# EasyEDA Pro project ProPrj_Micro-Profilometer_2025-09-25.epro, board PCB
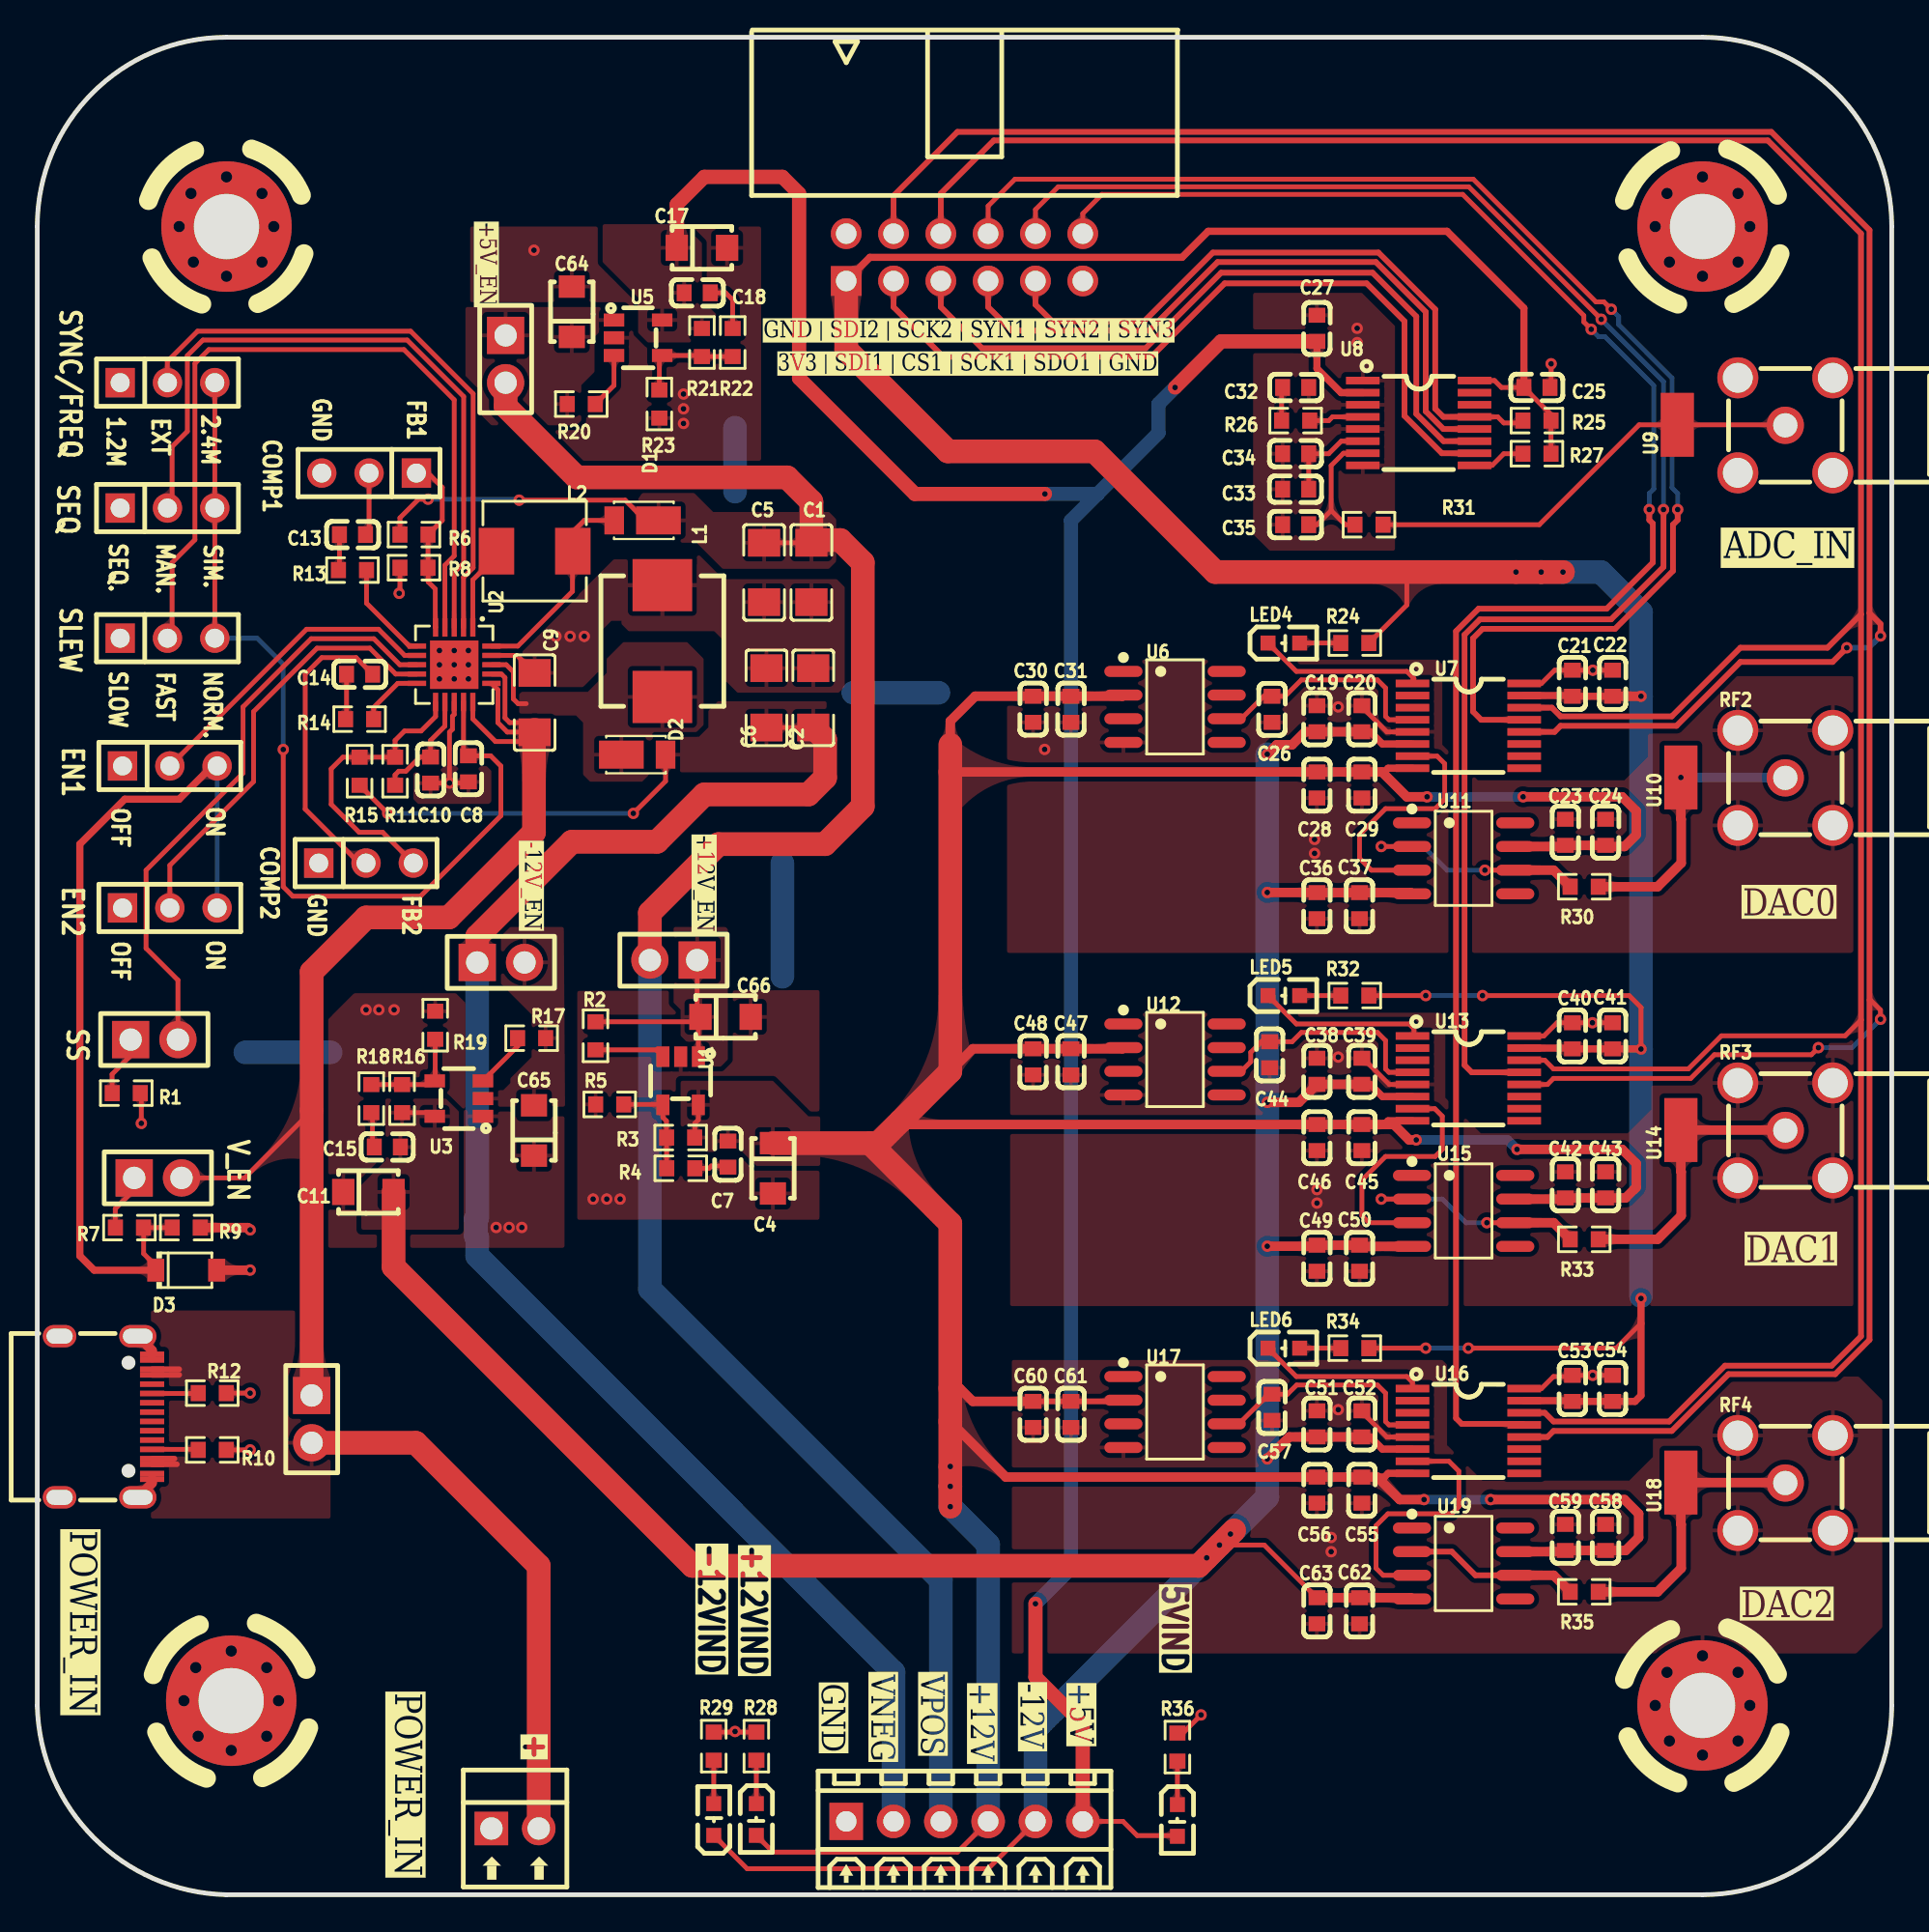
[diagram p3: board, top side]
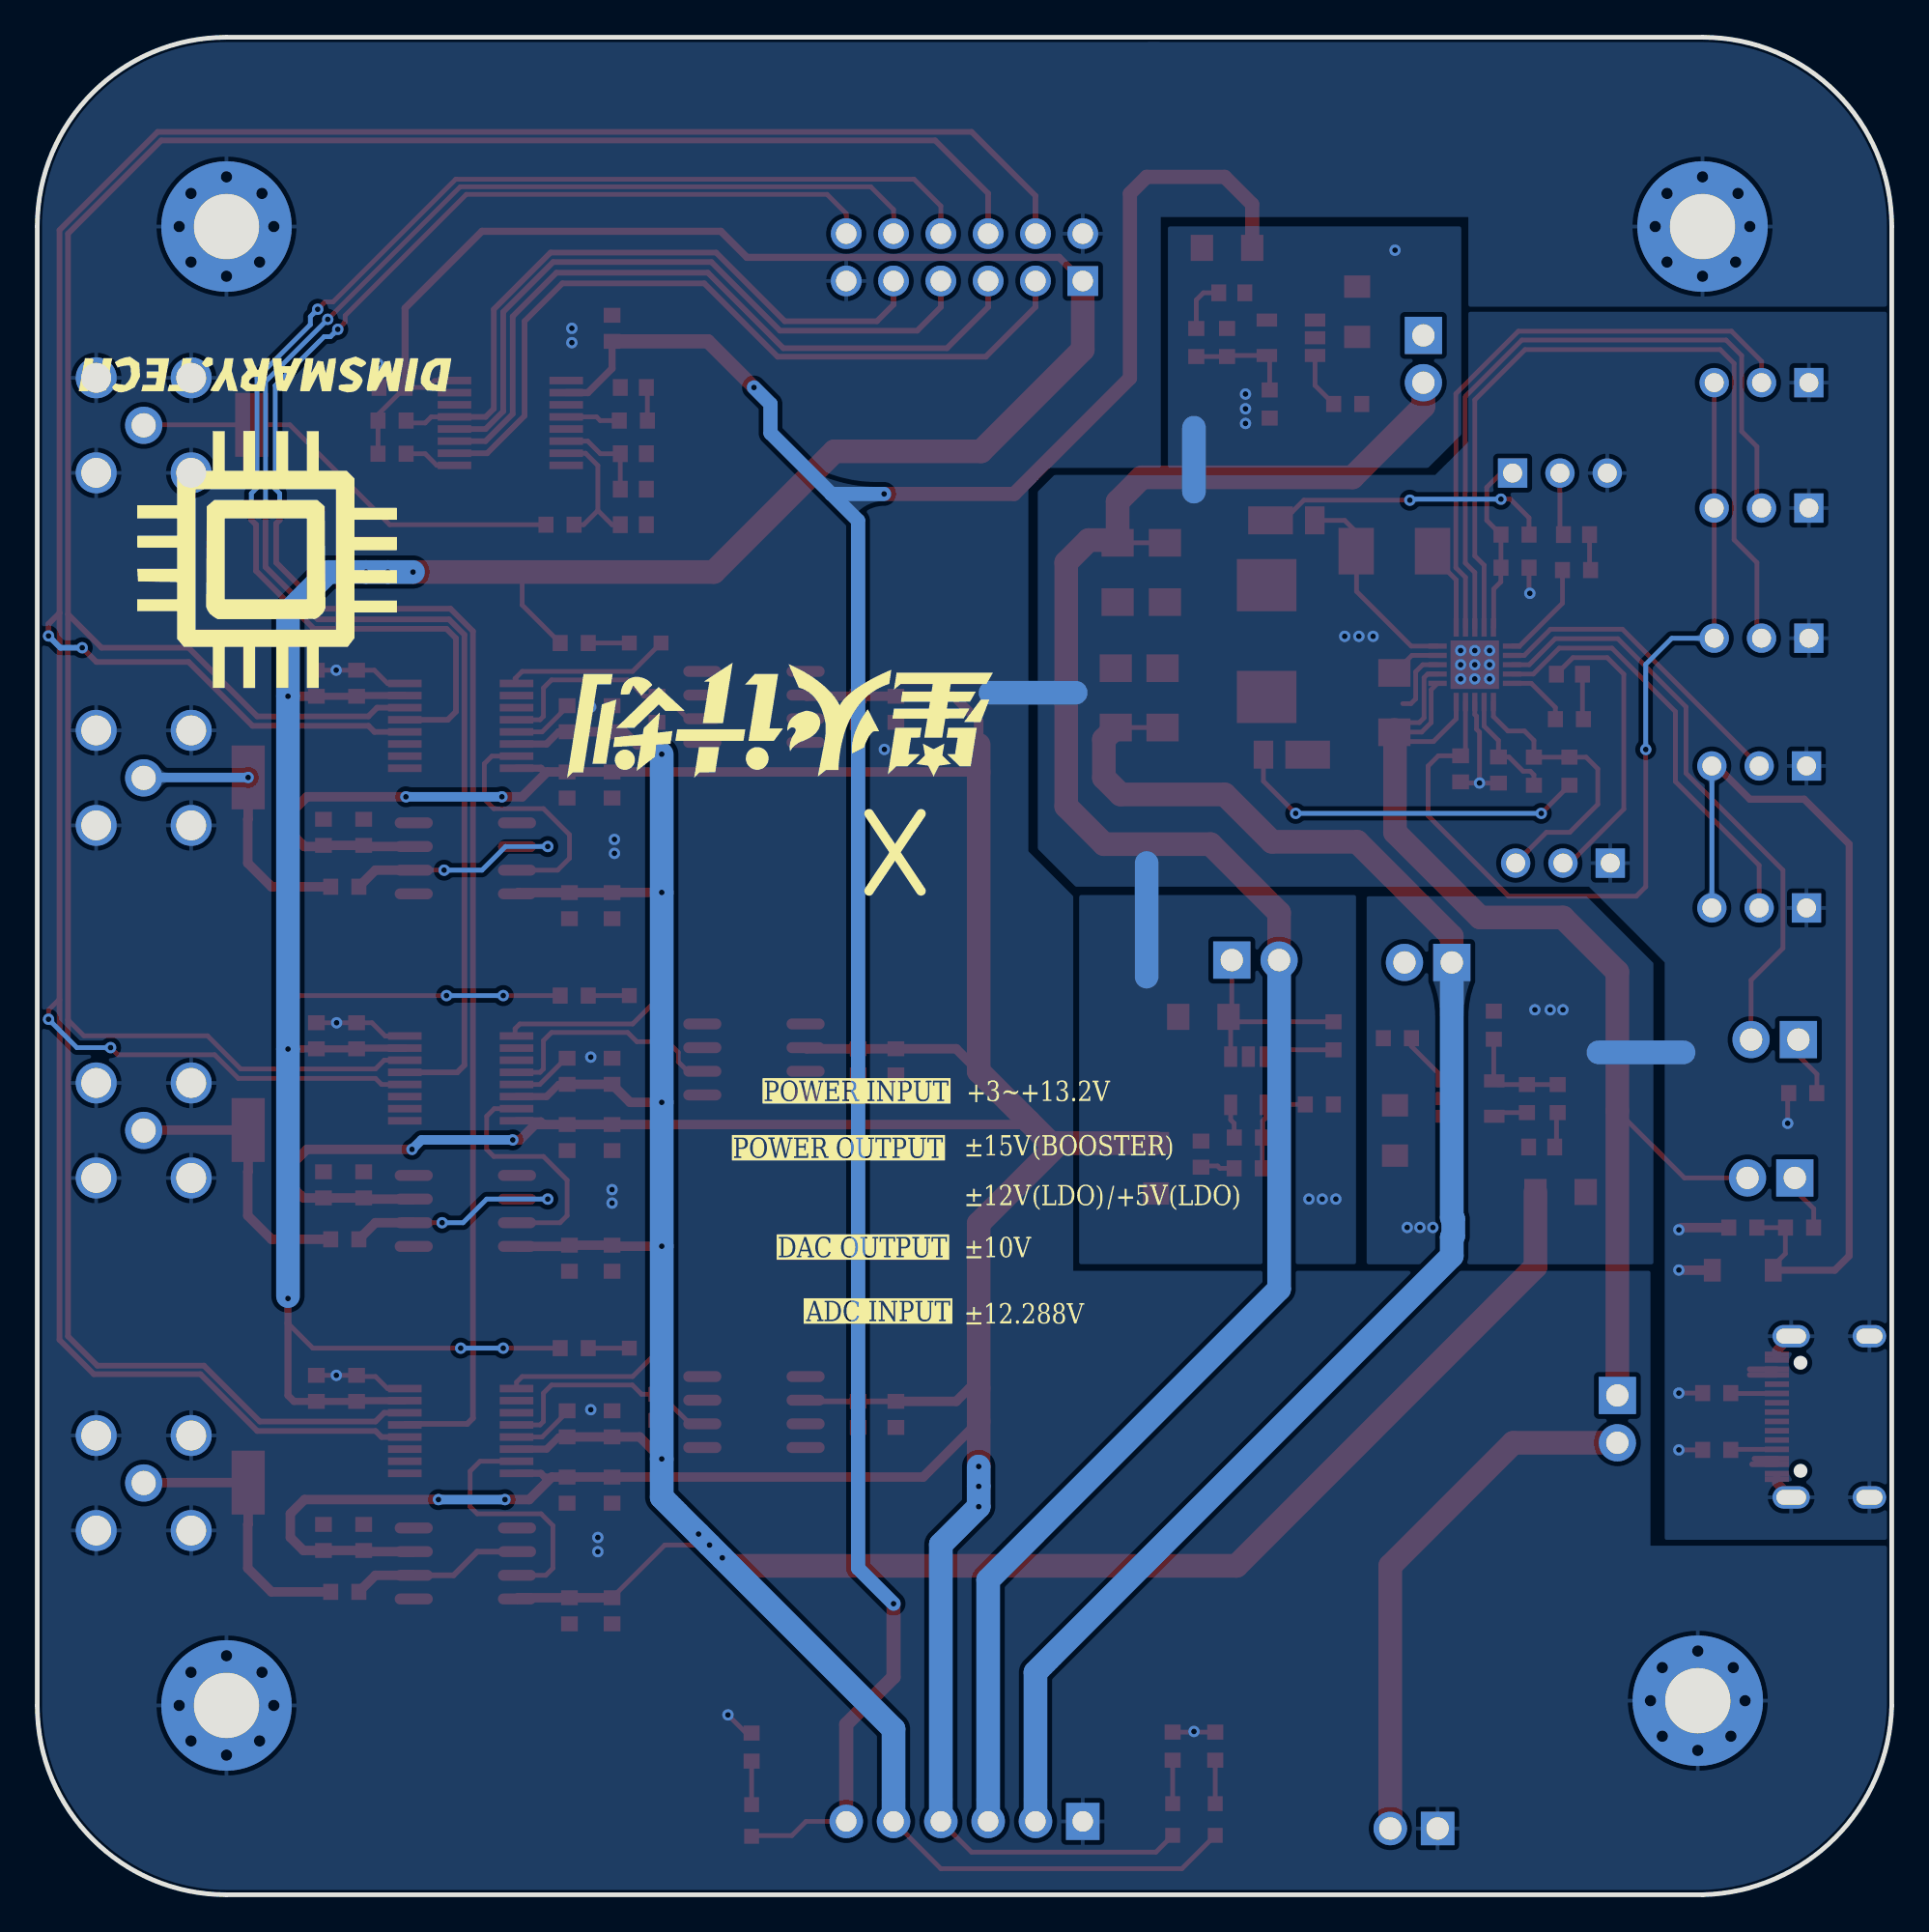
[diagram p4: board, bottom side, seen from below]

Outline 99.57 x 99.69 mm; copper layers: Top Layer, Bottom Layer. Coordinates in mm from the lower left corner of the outline.
Outline path: 0,89.53 arc(2.98,96.72) 10.16,99.69 89.41,99.69 arc(96.59,96.72) 99.57,89.53 99.57,10.16 arc(96.59,2.98) 89.41,0 10.16,0 arc(3.05,3.05) 0,10.16 0,89.53
Stack: Top Layer 0.035mm / Dielectric1 1.51mm FR4 er 4.5 / Bottom Layer 0.035mm

## Design rules (mm)
spacing safeClearance (default): track to track 0.152, other pairs 0.152 to 0.3
track width trackWidth (default): min 0.127, default 0.254, max 2.54
differential pair differentialPair (default): width min 0.127, default 0.254, max 2.54; gap min 0.152, default 0.152
via viaSize (default): diameter min 0.5, default 0.61, max 10; hole min 0.3, default 0.305, max 6

## Placement (name value [footprint] x y rotation side)
C1  10uF  [C1206]  41.56 70.97 270 top
C2  10uF  [C1206]  41.66 64.24 270 top
C4  2.2uF  [CAP-SMD_L3.2-W1.6]  39.5 38.99 270 top
C5  10uF  [C1206]  39.02 70.97 270 top
C6  10uF  [C1206]  39.15 64.24 270 top
C7  100nF  [C0603]  37.08 39.75 90 top
C8  1uF  [C0603]  23.15 60.43 270 top
C9  10uF  [C1206]  26.7 63.99 270 top
C10  1uF  [C0603]  21.12 60.36 270 top
C11  2.2uF  [CAP-SMD_L3.2-W1.6]  17.78 37.72 0 top
C13  47nF  [C0603]  16.93 73 180 top
C14  47nF  [C0603]  17.31 65.51 180 top
C15  100nF  [C0603]  18.8 40.13 0 top
C17  2.2uF  [CAP-SMD_L3.2-W1.6]  35.69 88.39 0 top
C18  100nF  [C0603]  35.43 85.98 180 top
C19  10uF  [C0603]  68.71 63.12 90 top
C20  100nF  [C0603]  71.12 63.12 90 top
C21  10uF  [C0603]  82.42 65.02 90 top
C22  100nF  [C0603]  84.58 65.02 90 top
C23  10uF  [C0603]  82.04 57.02 270 top
C24  100nF  [C0603]  84.2 57.02 270 top
C25  1uF  [C0603]  80.52 80.9 0 top
C26  100nF  [C0603]  66.29 63.63 90 top
C27  1uF  [C0603]  68.71 84.07 90 top
C28  10uF  [C0603]  68.71 59.56 90 top
C29  100nF  [C0603]  71.12 59.56 90 top
C30  10uF  [C0603]  53.47 63.63 270 top
C31  100nF  [C0603]  55.5 63.63 270 top
C32  10uF  [C0603]  67.56 80.9 180 top
C33  22uF  [C0603]  67.56 75.44 0 top
C34  1uF  [C0603]  67.56 77.34 0 top
C35  330pF  [C0603]  67.56 73.53 0 top
C36  10uF  [C0603]  68.71 53.09 90 top
C37  100nF  [C0603]  70.99 53.09 90 top
C38  10uF  [C0603]  68.71 44.2 90 top
C39  100nF  [C0603]  71.12 44.2 90 top
C40  10uF  [C0603]  82.42 46.1 90 top
C41  100nF  [C0603]  84.58 46.1 90 top
C42  10uF  [C0603]  82.04 38.1 270 top
C43  100nF  [C0603]  84.2 38.1 270 top
C44  100nF  [C0603]  66.17 45.08 90 top
C45  10uF  [C0603]  71.12 40.64 90 top
C46  100nF  [C0603]  68.71 40.64 90 top
C47  10uF  [C0603]  55.5 44.7 270 top
C48  100nF  [C0603]  53.47 44.7 270 top
C49  10uF  [C0603]  68.71 34.16 90 top
C50  100nF  [C0603]  70.99 34.16 90 top
C51  10uF  [C0603]  68.71 25.27 90 top
C52  100nF  [C0603]  71.12 25.27 90 top
C53  10uF  [C0603]  82.42 27.18 90 top
C54  100nF  [C0603]  84.58 27.18 90 top
C55  10uF  [C0603]  71.12 21.72 90 top
C56  100nF  [C0603]  68.71 21.72 90 top
C57  100nF  [C0603]  66.29 26.16 90 top
C58  10uF  [C0603]  84.2 19.18 270 top
C59  100nF  [C0603]  82.04 19.18 270 top
C60  10uF  [C0603]  53.47 25.78 270 top
C61  100nF  [C0603]  55.5 25.78 270 top
C62  10uF  [C0603]  70.99 15.24 90 top
C63  100nF  [C0603]  68.71 15.24 90 top
C64  2.2uF  [CAP-SMD_L3.2-W1.6]  28.7 84.96 90 top
C65  2.2uF  [CAP-SMD_L3.2-W1.6]  26.67 41.02 90 top
C66  2.2uF  [CAP-SMD_L3.2-W1.6]  36.96 47.12 0 top
CN1  X9555WR-2x06-6TV01  [IDC-TH_12P-P2.54_BOOMELE-2X6P]  49.78 87.88 180 top
D1  DFLS240-7  [POWERDI-123_L2.8-W1.8-LS3.7-RD]  32.17 73.76 180 top
D2  DFLS240-7  [POWERDI-123_L2.8-W1.8-LS3.7-RD]  32.55 61.19 0 top
D3  MMSZ5233B-7-F  [SOD-123_L2.7-W1.6-LS3.7-RD]  8 33.52 0 top
H1  -  [HDR-TH_3P-P2.54-V-F]  7.12 60.58 0 top
H2  -  [HDR-TH_3P-P2.54-V-F]  7.12 52.96 0 top
H3  -  [HDR-TH_3P-P2.54-V-F]  6.99 74.43 0 top
H4  -  [HDR-TH_2P-P2.54-V-F]  6.28 45.9 0 top
H5  -  [HDR-TH_2P-P2.54-V-F]  34.16 50.17 180 top
H6  -  [HDR-TH_3P-P2.54-V-F]  6.99 67.44 0 top
H7  -  [HDR-TH_3P-P2.54-V-F]  6.99 81.16 0 top
H8  -  [HDR-TH_2P-P2.54-V-F]  6.47 38.47 0 top
H9  -  [HDR-TH_2P-P2.54-V-F]  24.89 50.04 0 top
H10  -  [HDR-TH_3P-P2.54-V-F]  17.81 76.3 180 top
H11  -  [HDR-TH_3P-P2.54-V-F]  17.65 55.37 0 top
H12  -  [HDR-TH_2P-P2.54-V-F]  14.73 25.53 270 top
H13  -  [HDR-TH_2P-P2.54-V-F]  25.15 82.42 270 top
L1  6.8uH  [IND-SMD_L7.0-W6.6]  33.56 67.29 270 top
L2  4.7uH  [IND-SMD_L5.4-W5.2]  26.7 72.11 180 top
LED1  -  [LED0603-R-RD]  38.61 4.04 270 top
LED2  -  [LED0603-R-RD]  61.21 3.99 270 top
LED3  -  [LED0603-R-RD]  36.32 4.04 90 top
LED4  -  [LED0603-R-RD]  66.93 67.18 0 top
LED5  -  [LED0603-R-RD]  66.93 48.26 0 top
LED6  -  [LED0603-R-RD]  66.93 29.34 0 top
NOREF  -  [Pad_e702]  89.41 10.16 0 top
NOREF#2  -  [Pad_e389]  10.16 89.53 0 top
NOREF#3  -  [Pad_e689]  10.41 10.41 0 top
NOREF#4  -  [Pad_e670]  89.41 89.53 0 top
R1  49.9kΩ  [R0603]  4.78 43.02 180 top
R2  0Ω  [R0603]  29.97 46.1 270 top
R3  91kΩ  [R0603]  34.54 40.64 0 top
R4  1kΩ  [R0603]  34.55 38.99 0 top
R5  10kΩ  [R0603]  30.73 42.42 0 top
R6  2.43MΩ  [R0603]  20.23 73 0 top
R7  14.3kΩ  [R0603]  4.95 35.81 180 top
R8  137kΩ  [R0603]  20.23 71.22 0 top
R9  11kΩ  [R0603]  8 35.81 180 top
R10  5.1kΩ  [R0603]  9.4 23.88 180 top
R11  118kΩ  [R0603]  19.21 60.3 270 top
R12  5.1kΩ  [R0603]  9.4 26.92 0 top
R13  12kΩ  [R0603]  16.93 71.1 0 top
R14  10kΩ  [R0603]  17.31 63.1 0 top
R15  2.32MΩ  [R0603]  17.31 60.3 270 top
R16  52.3kΩ  [R0603]  19.59 42.73 270 top
R17  0Ω  [R0603]  26.54 45.97 180 top
R18  619Ω  [R0603]  17.94 42.73 270 top
R19  5.9kΩ  [R0603]  21.37 46.67 270 top
R20  0Ω  [R0603]  29.21 80.01 0 top
R21  31.6k  [R0603]  35.69 83.31 90 top
R22  1kΩ  [R0603]  37.34 83.31 90 top
R23  10k  [R0603]  33.4 80.01 90 top
R24  1kΩ  [R0603]  70.74 67.18 180 top
R25  10k  [R0603]  80.52 79.12 0 top
R26  0.47  [R0603]  67.56 79.12 0 top
R27  10k  [R0603]  80.52 77.34 0 top
R28  10kΩ  [R0603]  38.61 7.97 90 top
R29  10kΩ  [R0603]  36.32 7.97 90 top
R30  220  [R0603]  83.06 54.1 180 top
R31  0.47  [R0603]  71.5 73.53 0 top
R32  1kΩ  [R0603]  70.74 48.26 180 top
R33  220  [R0603]  83.06 35.18 180 top
R34  1kΩ  [R0603]  70.74 29.34 180 top
R35  220  [R0603]  83.06 16.26 180 top
R36  4.7kΩ  [R0603]  61.21 7.92 90 top
RF2  -  [SMA-TH_BWSMA-KWE-Z001]  93.85 59.94 0 top
RF3  -  [SMA-TH_BWSMA-KWE-Z001]  93.85 41.02 0 top
RF4  -  [SMA-TH_BWSMA-KWE-Z001]  93.85 22.1 0 top
RF9  -  [SMA-TH_BWSMA-KWE-Z001]  93.85 78.87 0 top
U1  ADP7118AUJZ-R7  [TSOT-23-5_L2.9-W1.6-P0.95-LS2.8-BR]  34.54 43.69 90 top
U2  ADP5070ACPZ-R7  [LFCSP-20_L4.0-W4.0-P0.50-TL-EP2.6]  22.39 66.02 270 top
U3  ADP7182AUJZ-R7  [TSOT-23-5_L2.9-W1.6-P0.95-LS2.8-BR]  22.64 42.73 0 top
U4  MX128-2.54-06P-GN01-Cu-Y-A  [CONN-TH_6P-P2.54_MX128-2.54-6P]  49.78 3.94 0 top
U5  ADP7118AUJZ-R7  [TSOT-23-5_L2.9-W1.6-P0.95-LS2.8-BR]  32.26 83.57 180 top
U6  -  [SOIC-8_L4.9-W3.9-P1.27-LS6.0-BL]  61.09 63.75 270 top
U7  -  [TSSOP-16_L5.0-W4.4-P0.65-LS6.4-TL]  76.84 62.74 0 top
U8  -  [TSSOP-16_L5.0-W4.4-P0.65-LS6.4-TL]  74.17 78.99 0 top
U9  -  [TEST-SMD_L2.7-W1.0]  88.05 78.89 90 top
U10  -  [TEST-SMD_L2.7-W1.0]  88.24 59.97 90 top
U11  -  [SOIC-8_L4.9-W3.9-P1.27-LS6.0-BL]  76.58 55.63 270 top
U12  -  [SOIC-8_L4.9-W3.9-P1.27-LS6.0-BL]  61.09 44.83 270 top
U13  -  [TSSOP-16_L5.0-W4.4-P0.65-LS6.4-TL]  76.84 43.81 0 top
U14  -  [TEST-SMD_L2.7-W1.0]  88.24 41.04 90 top
U15  -  [SOIC-8_L4.9-W3.9-P1.27-LS6.0-BL]  76.58 36.7 270 top
U16  -  [TSSOP-16_L5.0-W4.4-P0.65-LS6.4-TL]  76.84 24.89 0 top
U17  -  [SOIC-8_L4.9-W3.9-P1.27-LS6.0-BL]  61.09 25.91 270 top
U18  -  [TEST-SMD_L2.7-W1.0]  88.24 22.12 90 top
U19  -  [SOIC-8_L4.9-W3.9-P1.27-LS6.0-BL]  76.58 17.78 270 top
U20  DB125-2.54-2P-GN-S  [CONN-TH_DB125-2.54-2P-GN]  25.65 3.56 0 top
USBC1  -  [USB-C_SMD-TYPE-C-31-M-12]  3.68 25.65 270 top

## Footprints (pads in the part's own frame, mm; a bottom-side part is the same pattern mirrored in y, then rotated)
C0603
  rect 0.8x0.9 smd: 1(-0.7,0) 2(0.7,0)
C1206
  rect 1.485x1.728 smd: 1(-1.593,0) 2(1.593,0)
CAP-SMD_L3.2-W1.6
  rect 1.2x1.4 smd: 1(-1.35,0) 2(1.35,0)
CONN-TH_6P-P2.54_MX128-2.54-6P
  rect 1.8x2 hole 1.1: 1(-6.35,0)
  round 1.8 hole 1.1: 2(-3.81,0) 3(-1.27,0) 4(1.27,0) 5(3.81,0) 6(6.35,0)
CONN-TH_DB125-2.54-2P-GN
  rect 1.8x1.8 hole 1.2: 1(-1.27,0)
  round 1.8 hole 1.2: 2(1.27,0)
HDR-TH_2P-P2.54-V-F
  rect 1.999x1.999 hole 1.199: 1(-1.27,0)
  round 1.999 hole 1.199: 2(1.27,0)
HDR-TH_3P-P2.54-V-F
  rect 1.575x1.575 hole 1.02: 1(-2.54,0)
  round 1.575 hole 1.02: 2(0,0) 3(2.54,0)
IDC-TH_12P-P2.54_BOOMELE-2X6P
  rect 1.65x1.6 hole 1.1: 1(6.35,1.27)
  round 1.65 hole 1.1: 2(6.35,-1.27) 3(3.81,1.27) 4(3.81,-1.27) 5(1.27,1.27) 6(1.27,-1.27) 7(-1.27,1.27) 8(-1.27,-1.27) 9(-3.81,1.27) 10(-3.81,-1.27) 11(-6.35,1.27) 12(-6.35,-1.27)
IND-SMD_L5.4-W5.2
  rect 1.9x2.5 smd: 1(2.05,0) 2(-2.05,0)
IND-SMD_L7.0-W6.6
  rect 2.8x3.2 smd: 1(-3,0) 2(3,0)
LED0603-R-RD
  rect 0.8x0.8 smd: 1(0.851,0) 2(-0.851,0)
LFCSP-20_L4.0-W4.0-P0.50-TL-EP2.6
  rect 0.985x0.28 smd: 1(-2,1) 2(-2,0.5) 3(-2,0) 4(-2,-0.5) 5(-2,-1) 11(2,-1) 12(2,-0.5) 13(2,0) 14(2,0.5) 15(2,1)
  rect 0.28x0.985 smd: 6(-1,-2) 7(-0.5,-2) 8(0,-2) 9(0.5,-2) 10(1,-2) 16(1,2) 17(0.5,2) 18(0,2) 19(-0.5,2) 20(-1,2)
  rect 2.6x2.6 smd: 21(0,0)
Pad_e389
  round 7 hole 3.5: 1(0,0)
Pad_e670
  round 7 hole 3.5: 1(0,0)
Pad_e689
  round 7 hole 3.5: 1(0,0)
Pad_e702
  round 7 hole 3.5: 1(0,0)
POWERDI-123_L2.8-W1.8-LS3.7-RD
  rect 2.4x1.5 smd: 1(-1.188,0)
  rect 1.05x1.5 smd: 2(1.188,0)
R0603
  rect 0.807x0.864 smd: 1(-0.754,0) 2(0.754,0)
SMA-TH_BWSMA-KWE-Z001
  round 2.2 hole 1.6: 1(-2.55,-2.55) 2(-2.55,2.55) 3(2.55,2.55) 4(2.55,-2.55)
  round 2 hole 1.3: 5(0,0)
SOD-123_L2.7-W1.6-LS3.7-RD
  rect 0.91x1.22 smd: 1(-1.635,0) 2(1.635,0)
SOIC-8_L4.9-W3.9-P1.27-LS6.0-BL
  oval 0.59x2.045 smd: 1(-1.905,-2.771) 2(-0.635,-2.771) 3(0.635,-2.771) 4(1.905,-2.771) 5(1.905,2.773) 6(0.635,2.773) 7(-0.635,2.773) 8(-1.905,2.773)
TEST-SMD_L2.7-W1.0
  rect 3.429x1.78 smd: 1(0,0)
TSOT-23-5_L2.9-W1.6-P0.95-LS2.8-BR
  rect 1.1x0.7 smd: 1(1.294,-0.951) 2(1.294,-0.001) 3(1.294,0.951) 4(-1.294,0.951) 5(-1.294,-0.949)
TSSOP-16_L5.0-W4.4-P0.65-LS6.4-TL
  rect 1.804x0.406 smd: 1(-2.999,2.276) 2(-2.999,1.625) 3(-2.999,0.976) 4(-2.999,0.325) 5(-2.999,-0.325) 6(-2.999,-0.976) 7(-2.999,-1.625) 8(-2.999,-2.276) 9(2.999,-2.276) 10(2.999,-1.625) 11(2.999,-0.976) 12(2.999,-0.325) 13(2.999,0.325) 14(2.999,0.976) 15(2.999,1.625) 16(2.999,2.276)
USB-C_SMD-TYPE-C-31-M-12
  oval 1.2x2 hole 0.8x1.6: 0(-4.325,1.716) 0(4.325,1.716)
  oval 1.2x1.8 hole 0.8x1.4: 0(-4.325,-2.484) 0(4.325,-2.484)
  rect 0.3x1.3 smd: A1(-3.35,2.484) A4(-2.55,2.484) A5(-1.25,2.484) A6(-0.25,2.484) A7(0.25,2.484) A8(1.25,2.484) A9(2.55,2.484) A12(3.35,2.484) B1(3.05,2.484) B4(2.25,2.484) B5(1.75,2.484) B6(0.75,2.484) B7(-0.75,2.484) B8(-1.75,2.484) B9(-2.25,2.484) B12(-3.05,2.484)

## Nets
As in the schematic, except:
AGND: C1.2 C2.1 C4.2 C5.2 C6.1 C8.2 C9.1 C10.2 C11.1 C17.2 C19.2 C20.2 C21.2 C22.2 C23.1 C24.1 C25.2 C26.1 C27.2 C28.1 C29.1 C30.2 C31.2 C32.1 C33.1 C34.1 C35.1 C36.1 C37.1 C38.2 C39.2 C40.2 C41.2 C42.1 C43.1 C44.1 C45.1 C46.1 C47.2 C48.2 C49.1 C50.1 C51.2 C52.2 C53.2 C54.2 C55.1 C56.1 C57.1 C58.1 C59.1 C60.2 C61.2 C62.1 C63.1 C64.2 C65.1 C66.2 CN1.2 CN1.11 D3.2 H1.1 H2.1 H3.1 H6.1 H7.1 H10.3 H11.1 L1.1 NOREF.1 NOREF#2.1 NOREF#3.1 NOREF#4.1 R1.1 R5.1 R8.1 R9.1 R10.1 R12.2 R19.1 R23.1 R28.2 R29.2 R36.2 RF2.1 RF2.2 RF2.3 RF2.4 RF3.1 RF3.2 RF3.3 RF3.4 RF4.1 RF4.2 RF4.3 RF4.4 RF9.1 RF9.2 RF9.3 RF9.4 U1.2 U2.13 U2.19 U2.21 U3.1 U4.1 U5.2 U6.4 U7.5 U7.16 U8.1 U8.3 U8.5 U8.8 U12.4 U13.5 U13.16 U16.5 U16.16 U17.4 U20.1 USBC1.0 USBC1.A1 USBC1.A12 USBC1.B1 USBC1.B12

Pads without a net: U6 1 3 5 7 8; U7 2 3 9 10 11; U8 14 15; U11 1 5 8; U12 1 3 5 7 8; U13 2 3 9 10 11; U15 1 5 8; U16 2 3 9 10 11; U17 1 3 5 7 8; U19 1 5 8; USBC1 A6 A7 A8 B6 B7 B8

## Via types
v1: diameter 1.219, hole 0.61, Top Layer to Bottom Layer, 32 vias
v2: diameter 0.61, hole 0.305, Top Layer to Bottom Layer, 100 vias

## Routing (per net, layer and track width the routed paths; a pad name or vN(x,y) marks a point on that pad's centre or on a via; arc(x,y) is an arc through that point)
3V3: length 202.7
  Top Layer w0.254: 86.11,30.67 84.77,29.34 v2(76.84,29.34) ; U8.16 78.24,81.27 78.61,80.9 C25.1 81.27,79.44 R25.2 R27.2 ; v2(77.6,48.26) 85.47,48.26 86.11,47.62 v2(86.11,45.39) ; R24.1 73.53,69.22 73.53,70.74 ; R34.1 v2(74.55,29.34) ; R32.1 v2(74.55,48.26)
  Top Layer w0.381: U16.15 82.38,26.52 C53.1 C54.1 85.79,26.48 86.11,26.8 v2(86.11,32) ; CN1.1 44.7,87.88 61.47,87.88 62.87,89.28 75.69,89.28 79.82,85.16 C25.1 ; U7.15 82.38,64.36 C21.1 C22.1 ; 86.11,45.4 C41.1 C40.1 82.38,45.44 U13.15
  Top Layer w0.508: C22.1 v2(86.11,64.32)
  Top Layer w1.27: v2(81.91,70.99) v2(80.75,70.99) v2(79.39,70.99) 63.25,70.99 56.77,77.47 48.9,77.47 43.43,82.93 CN1.1
  Bottom Layer w0.254: v2(74.55,29.34) v2(76.84,29.34) ; v2(74.55,48.26) v2(77.6,48.26)
  Bottom Layer w1.27: v2(79.39,70.99) v2(80.75,70.99) v2(81.91,70.99) 83.95,70.99 86.11,68.83 v2(86.11,64.32) v2(86.11,45.39) 86.11,32.13
+5V: length 65.2
  Top Layer w0.254: U2.17 24.92,65.52 25.11,65.33 25.11,63.17 25.36,62.91 26.19,62.91 26.57,62.53 ; U2.16 24.73,64.67 24.73,62.91 25.24,62.4 26.44,62.4 ; U2.15 23.39,63.11 24.6,61.9 26.21,61.9 26.58,62.27 ; 14.73,42.08 11.13,38.47 H8.2
  Top Layer w1.27: 26.67,62.36 26.67,57.02 22.1,52.45 17.65,52.45 14.73,49.53 H12.1
  Top Layer w1.524: 26.67,62.36 C9.2
+5VLDO: length 138
  Top Layer w0.254: U4.6 58.29,3.94 59.06,3.18 61.18,3.18 LED2.1
  Top Layer w0.381: U8.2 70,80.62 68.71,81.92 C27.1
  Top Layer w0.762: C27.1 63.56,83.37 v2(61.09,80.9) ; v2(54.1,75.18) 47.12,75.18 40.9,81.4 40.9,91.3 40,92.2 35.81,92.2 34.34,90.72 34.34,88.39 ; U4.6 56.13,9.14 53.59,11.68 v2(53.59,15.62)
  Bottom Layer w0.762: v2(53.59,15.62) 55.5,17.53 55.5,73.75 56.93,75.18 ; v2(54.1,75.18) 56.93,75.18 ; 56.93,75.18 60.2,78.45 60.2,80.01 v2(61.09,80.9)
+12V: length 262.3
  Top Layer w0.254: R3.2 35.31,40.65 35.31,41.4 35.49,41.59 35.49,42.39 ; U4.4 49.4,2.29 39.51,2.29 LED1.1
  Top Layer w0.305: U17.2 58.25,26.48 53.47,26.48
  Top Layer w0.381: 72.33,41.34 72.53,41.54 U13.8 ; 71.94,22.42 72.33,22.42 72.53,22.62 U16.8 ; 72.2,60.26 72.33,60.26 72.53,60.46 U7.8
  Top Layer w0.508: v2(74.46,21.21) 73.15,21.21 71.94,22.42 52,22.42 49.02,25.4 ; 49.02,60.25 49.03,60.26 C28.2 C29.2 72.2,60.26 73.53,58.93 v2(74.62,58.93) ; v2(78.03,21.21) 85.22,21.21 85.98,20.45 85.98,19.18 85.28,18.48 C58.2 C59.2 81.98,18.41 U19.7 ; 58.32,64.39 58.25,64.33 C31.1 C30.1 50.36,64.33 49.02,62.99 49.02,61.98 ; v2(79.78,58.93) 85.09,58.93 85.85,58.17 85.85,56.9 85.22,56.26 84.26,56.26 C24.2 C23.2 81.98,56.26 79.35,56.26 ; 53.47,26.48 50.23,26.48 49.53,27.18 49.02,27.18 ; U12.2 58.25,45.4 C47.1 C48.1 50.23,45.4 49.02,44.2 ; v2(74.04,40.51) 73.66,40.51 72.83,41.34 C45.2 C46.2 46.53,41.34 46.35,41.52 ; v2(79.45,40) 85.09,40 85.85,39.24 85.85,37.97 85.28,37.4 C43.2 C42.2 81.98,37.34 U15.7
  Top Layer w1.27: v2(49.02,20.83) v2(49.02,21.92) v2(49.02,22.99) 49.02,36.03 44.71,40.34 ; 44.71,40.34 45.16,40.34 49.02,44.2 49.02,61.72 ; 44.71,40.34 C4.1
  Bottom Layer w0.508: v2(79.45,40) 78.94,40.51 v2(74.04,40.51) ; v2(74.46,21.21) v2(78.03,21.21) ; v2(74.62,58.93) v2(79.78,58.93)
  Bottom Layer w1.27: v2(49.02,22.99) v2(49.02,21.92) v2(49.02,20.83) 51.05,18.8 U4.4
-12V: length 192.7
  Top Layer w0.254: U3.5 21.15,41.98 R16.2 ; v2(63.47,18.77) 65.88,18.77 C63.2 ; LED3.2 38.11,1.4 51.05,1.4 U4.5
  Top Layer w0.381: U13.6 72.22,42.84 71.57,43.5 C39.1 ; U16.6 72.22,23.92 71.57,24.57 C52.1 ; U7.6 72.22,61.76 71.57,62.42 C20.1
  Top Layer w0.508: C52.1 C51.1 67.22,24.57 v2(66.04,23.39) ; v2(66.04,53.79) 68.7,53.79 C36.2 C37.2 73.75,53.79 U11.4 ; C63.2 C62.2 73.75,15.94 U19.4 ; v2(66.04,42.53) 67.74,42.53 C38.1 C39.1 ; v2(66.04,61.21) 66.55,61.72 67.38,61.72 68.07,62.42 C19.1 C20.1 ; v2(66.04,34.81) 68.65,34.81 C49.2 C50.2 71.06,34.8 U15.4
  Top Layer w1.27: C11.2 19.13,33.7 35.18,17.65 62.36,17.65 v2(62.79,18.08) v2(63.47,18.77) 64.26,19.56
  Bottom Layer w1.27: U4.5 53.59,8.89 v2(62.79,18.08) v2(63.47,18.77) v2(64.06,19.36) 66.04,21.34 v2(66.04,23.39) v2(66.04,34.81) v2(66.04,42.53) v2(66.04,53.79) v2(66.04,61.21)
AGND: length 71.5
  Top Layer w0.254: C8.2 23.09,59.67 v2(22.13,59.67) ; v2(22.13,59.67) 22.13,62.39 22.29,62.56 22.29,63.25 22.39,63.35 U2.13 ; v2(22.13,59.67) 22.13,59.66 C10.2 ; C25.2 81.28,80.96 v2(81.28,82.17) ; C22.2 v2(83.52,65.72) C21.2 81.47,65.72 80.76,65.01 U7.16 ; U13.5 72.59,43.49 71.18,44.9 C39.2 ; R1.1 5.59,42.97 v2(5.59,41.4) ; U16.16 80.76,27.17 81.41,27.81 82.36,27.81 C53.2 v2(83.51,27.88) C54.2 ; R12.2 v2(11.43,26.92) ; v2(19.43,69.85) 19.47,69.89 R8.1 ; v2(62.48,9.65) 61.51,8.68 R36.2 ; C41.2 v2(83.5,46.8) C40.2 81.6,46.8 80.89,46.09 U13.16 ; USBC1.A12 USBC1.B1 ; U2.19 25.77,66.52 C9.1 ; C52.2 71.12,25.91 72.46,24.57 U16.5 ; R29.2 R28.2 ; C20.2 71.12,63.75 72.46,62.41 U7.5 ; R10.1 v2(11.43,23.88) ; USBC1.A1 USBC1.B12
  Top Layer w0.508: USBC1.A12 6.17,22.1 USBC1.0 ; USBC1.A1 6.17,29.21 USBC1.0 ; R9.1 11.31,35.81 v2(11.43,35.69) ; D3.2 11.42,33.52 v2(11.43,33.53)
  Bottom Layer w1.27: 37.47,78.74 37.47,75.31 ; 15.75,45.21 11.18,45.21 ; 40,49.28 40,55.37 ; 43.81,64.52 48.39,64.52
  vias: v1(7.62,89.53) v1(7.87,10.41) v1(8.25,91.31) v1(8.38,87.63) v1(8.51,12.19) v1(8.64,8.51) v1(10.16,92.2) v1(10.16,86.87) v1(10.41,13.08) v1(10.41,7.75) v1(12.06,91.31) v1(12.06,87.63) v1(12.32,12.19) v1(12.32,8.51) v1(12.7,89.53) v1(12.95,10.41) v1(86.87,89.53) v1(86.87,10.16) v1(87.5,91.31) v1(87.5,11.94) v1(87.63,87.63) v1(87.63,8.25) v1(89.41,92.2) v1(89.41,86.87) v1(89.41,12.83) v1(89.41,7.49) v1(91.31,91.31) v1(91.31,87.63) v1(91.31,11.94) v1(91.31,8.25) v1(91.95,89.53) v1(91.95,10.16) v2(17.65,47.5) v2(18.34,47.5) v2(19.16,47.5) v2(21.59,66.78) v2(21.59,66.02) v2(21.59,65.26) v2(22.39,66.78) v2(22.39,66.02) v2(22.39,65.26) v2(23.15,66.78) v2(23.15,66.02) v2(23.15,65.26) v2(24.64,35.81) v2(25.33,35.81) v2(26.02,35.81) v2(26.67,88.27) v2(27.85,67.54) v2(28.61,67.54) v2(29.37,67.54) v2(29.84,37.34) v2(30.58,37.34) v2(31.29,37.34) v2(34.7,80.54) v2(34.7,79.75) v2(34.7,78.97) v2(37.47,8.76) v2(54.09,61.47) v2(68.58,56.64) v2(68.58,55.89) v2(68.71,37.85) v2(68.71,37.12) v2(69.47,19.18) v2(69.47,18.41) v2(69.85,63.75) v2(69.85,44.96) v2(69.85,26.03) v2(70.87,84.07) v2(70.87,83.31)
ADCIN: length 23.8
  Top Layer w0.254: R31.2 80.65,73.53 86.01,78.89 U9.1 93.83,78.89 RF9.5
CS1: length 39.5
  Top Layer w0.305: U8.11 75.5,78.02 74.04,79.48 74.04,84.71 71.69,87.06 63.56,87.06 59.51,83.01 50.72,83.01 48.51,85.22 CN1.5
DAC_OUT1: length 12.7
  Top Layer w0.254: U11.6 v2(77.72,54.99) ; v2(72.16,56.26) 73.81,56.26
  Top Layer w0.508: R30.2 81.41,54.99 U11.6
  Bottom Layer w0.254: v2(72.16,56.26) 74.42,56.26 75.69,54.99 v2(77.72,54.99)
DAC_OUT2: length 12.7
  Top Layer w0.254: v2(77.83,36.07) U15.6 ; v2(72.16,37.34) U15.2
  Top Layer w0.508: R33.2 81.41,36.07 U15.6
  Bottom Layer w0.254: v2(72.16,37.34) 75.44,37.34 76.71,36.07 v2(77.83,36.07)
DAC_OUT3: length 9.4
  Top Layer w0.305: U19.2 75.95,18.41 77.22,17.15 U19.6
  Top Layer w0.508: R35.2 81.41,17.15 U19.6
EN1: length 16.9
  Top Layer w0.254: U2.7 19.73,66.52 18.32,67.92 14.46,67.92 H1.2
EN2: length 23.2
  Top Layer w0.254: U2.9 19.24,65.52 17.85,66.91 15.02,66.91 11.61,63.5 11.61,59.75 7.12,55.25 H2.2
SCLK1: length 36.4
  Top Layer w0.305: CN1.7 51.05,85.22 52.32,83.95 59.69,83.95 63.37,87.63 71.87,87.63 74.55,84.95 74.55,79.62 75.5,78.67 U8.12
SCLK2: length 174.1
  Top Layer w0.254: U13.14 80.94,44.79 81.41,44.32 88.65,44.32 90.42,46.1 97.06,46.1 97.92,46.95
  Top Layer w0.305: CN1.6 48.51,91.31 51.36,94.16 92.91,94.16 97.92,89.15 97.92,68.73 ; U7.14 81.32,63.71 81.79,63.25 87.76,63.25 91.44,66.93 96.12,66.93 97.92,68.73 ; 97.92,68.73 97.92,29.97 96.34,28.4 90.62,28.4 87.62,25.4 81.41,25.4 80.94,25.87 U16.14
SDI1: length 42.1
  Top Layer w0.305: CN1.3 45.97,85.22 48.64,82.55 59.82,82.55 63.75,86.49 71.37,86.49 73.41,84.45 73.41,79.38 75.41,77.37 U8.10
SDI2: length 182.9
  Top Layer w0.254: v2(95.63,45.47) 95.25,45.08 90.04,45.08 88.77,43.81 81.41,43.81 81.08,43.49 U13.12 ; v2(98.96,46.99) 98.96,47.48 98.43,48.02 98.37,48.02
  Top Layer w0.305: CN1.4 45.97,91.19 49.4,94.62 93.1,94.62 98.37,89.34 98.37,68.79 ; 98.37,68.79 98.96,68.2 v2(98.96,67.56) ; 98.37,68.79 98.37,29.78 96.53,27.94 90.81,27.94 87.76,24.89 81.41,24.89 81.08,24.57 U16.12 ; v2(97.16,66.93) 96.39,66.17 91.44,66.17 88.01,62.74 81.79,62.74 81.46,62.41 U7.12
  Bottom Layer w0.254: v2(95.63,45.47) 97.44,45.47 v2(98.96,46.99)
  Bottom Layer w0.305: v2(97.16,66.93) 98.33,66.93 v2(98.96,67.56)
SDO1: length 36.3
  Top Layer w0.254: R25.1 79.64,78.99 78.74,78.99 78.41,79.32 U8.13
  Top Layer w0.305: U8.13 75.49,79.32 75.06,79.76 75.06,85.09 72.01,88.14 63.12,88.14 59.44,84.45 54.48,84.45 53.59,85.34 CN1.9
SEQ: length 37.7
  Top Layer w0.254: U2.3 22.39,70.97 22.89,71.48 22.89,80.41 19.86,83.44 8.89,83.44 8.06,82.61 8.06,78.54 7.24,77.72 7.24,74.67 H3.2
SLEW: length 43.1
  Top Layer w0.254: H6.2 7.24,67.69 7.24,71.5 8.47,72.73 8.47,82.19 9.21,82.93 19.69,82.93 22.39,80.23 22.39,71.86 21.89,71.36 U2.4
SS: length 32.2
  Top Layer w0.254: H4.2 7.55,49.09 5.84,50.8 5.84,54.99 11.05,60.2 11.05,63.75 14.71,67.41 18.07,67.41 19.47,66.02 U2.8
SYNC: length 32.4
  Top Layer w0.254: H7.2 6.98,81.17 6.98,82.3 8.61,83.92 20.05,83.92 23.4,80.56 23.4,71.22 22.89,70.71 U2.2
SYNC1: length 73.1
  Top Layer w0.254: v2(84.51,85.1) 84.11,85.49 83.68,85.49 77.1,92.08 52.49,92.08 51.05,90.64 CN1.8
  Top Layer w0.305: v2(88.07,74.35) 88.07,73.79 87.82,73.53 87.82,71.05 84.71,67.94 77.6,67.94 77.09,67.44 77.09,63.5 77.53,63.06 U7.13
  Bottom Layer w0.254: v2(84.51,85.1) 84.91,84.7 84.91,84.27 87.77,81.41 87.77,75.52 88.07,75.21 v2(88.07,74.35)
SYNC2: length 88.4
  Top Layer w0.254: CN1.10 53.59,90.45 54.81,91.67 76.86,91.67 v2(83.97,84.56)
  Top Layer w0.305: v2(87.31,74.35) 87.31,71.26 84.5,68.45 77.46,68.45 76.63,67.63 76.63,44.53 77.02,44.14 U13.13
  Bottom Layer w0.254: v2(83.97,84.56) 87.31,81.22 v2(87.31,74.35)
SYNC3: length 104.4
  Top Layer w0.254: v2(83.43,84.02) 83.04,84.41 83.04,84.76 76.53,91.26 57.16,91.26 56.13,90.23 CN1.12
  Top Layer w0.305: v2(86.55,74.35) 86.55,73.79 86.74,73.6 86.74,71.5 84.26,69.02 77.38,69.02 76.17,67.82 76.17,25.58 76.48,25.27 79.78,25.27 U16.13
  Bottom Layer w0.254: v2(86.55,74.35) 86.55,75.21 86.79,75.45 86.79,81 84.17,83.62 83.83,83.62 v2(83.43,84.02)
USB_VCC: length 34.3
  Top Layer w0.305: USBC1.B4 7.37,23.4 ; USBC1.B9 7.62,27.9 ; USBC1.A4 7.62,28.2 ; USBC1.A9 7.49,23.1
  Top Layer w1.27: 26.92,3.68 26.92,17.65 20.32,24.26 H12.2
V_EN: length 47.3
  Top Layer w0.254: D3.1 6.36,33.76 5.71,34.41 5.71,35.8 R7.1 R9.2
  Top Layer w0.381: H1.3 9.4,60.58 7.62,58.8 4.7,58.8 2.29,56.39 2.29,34.29 3.06,33.52 D3.1
  Bottom Layer w0.254: H1.3 H2.3
VNEG: length 103.7
  Top Layer w0.254: 17.31,59.55 v2(18.82,58.04) ; D2.2 33.73,59.77 v2(32,58.04) ; C6.2 41.66,62.65
  Top Layer w1.27: H9.1 23.62,51.44 28.7,56.52 33.27,56.52 35.81,59.06 41.4,59.06 42.3,59.95 42.3,62.01 C2.2
  Bottom Layer w0.254: v2(18.82,58.04) v2(32,58.04)
  Bottom Layer w1.27: H9.1 23.62,36.34 23.55,36.27 23.55,35.36 23.62,35.28 23.62,34.29 45.97,11.94 U4.2
VPOS: length 125.7
  Top Layer w0.254: C5.1 C1.1 ; R6.1 19.47,73.9 20.47,74.9 v2(20.98,74.9) ; D1.1 32.9,74.22 32.2,74.22 31.56,74.85 v2(25.87,74.85)
  Top Layer w1.27: H13.2 25.15,79.88 28.96,76.07 40.26,76.07 41.56,74.77 C1.1 41.71,72.71 43.12,72.71 44.32,71.5 44.32,58.42 42.29,56.39 36.58,56.39 32.89,52.7 H5.2
  Bottom Layer w0.254: v2(25.87,74.85) 25.82,74.9 v2(20.98,74.9)
  Bottom Layer w1.27: H5.2 32.89,32.51 48.51,16.89 U4.3
VREF1: length 12.6
  Top Layer w0.254: U6.6 64.64,63.12 65.85,64.33 C26.2 66.99,64.33 67.87,65.2 71.96,65.2 72.39,64.77 72.39,63.25 72.57,63.06 U7.4
VREF2: length 12.9
  Top Layer w0.254: U12.6 64.64,44.2 65.15,44.7 65.15,45.21 65.72,45.78 C44.2 67.38,45.78 67.87,46.28 71.96,46.28 72.39,45.85 72.39,44.32 72.57,44.14 U13.4
VREF3: length 12.6
  Top Layer w0.254: U17.6 64.52,25.27 66.1,26.86 C57.2 67.12,26.86 67.62,27.36 71.96,27.36 72.39,26.92 72.39,25.4 72.57,25.22 U16.4
VREG: length 51.2
  Top Layer w0.254: H7.3 H3.3 H6.3 ; U2.14 22.89,61.08 22.89,61.07 ; C8.1 24.34,61.13 24.89,60.58 24.89,57.91 20.57,53.59 13.72,53.59 13.21,54.1 v2(13.21,61.47)
  Bottom Layer w0.254: H6.3 9.54,67.44 11.81,67.44 13.21,66.04 v2(13.21,61.47)
$1N2268: length 4.6
  Top Layer w0.254: L2.1 24.65,71.84 23.39,70.57 U2.1
$1N2301: length 11.2
  Top Layer w0.254: D1.2 29.37,73.76 28.75,73.15 L2.2 28.74,72.1 28.74,69.95 25.8,67.02 U2.20
$1N2768: length 3.6
  Top Layer w0.254: 26.25,63.93 25.81,63.93 25.56,64.18 25.56,65.64 25.18,66.02 U2.18
$1N4863: length 6.1
  Top Layer w0.254: U2.12 21.89,62.72 21.12,61.95 C10.1 20.55,61.06 19.79,60.3 19.41,60.3 19.21,60.11 19.21,59.55
$1N5027: length 9.7
  Top Layer w0.254: U2.5 21.37,68.03 21.37,70.08 20.99,70.46 20.99,71.22 20.98,71.22 20.98,73 21.74,73.77 21.74,75.54 20.98,76.3 H10.1
$1N5900: length 15.7
  Top Layer w0.254: U2.11 21.39,63.24 20.61,62.46 19.72,62.46 19.21,61.95 R11.1 R15.1 16.41,61.06 15.78,60.43 15.78,58.52 17.28,57.02 18.54,57.02 20.19,55.37
$1N6634: length 5.4
  Top Layer w0.254: U2.6 19.98,67.02 17.68,69.32 R13.2
$1N6660: length 3.5
  Top Layer w0.254: R14.2 18.06,63.72 19.35,65.02 U2.10
$1N6686: length 1.9
  Top Layer w0.254: C13.2 16.23,71.15 R13.1
$1N6748: length 2.4
  Top Layer w0.254: R14.1 16.61,63.15 C14.2
$1N7096: length 3.4
  Top Layer w0.254: H10.2 17.81,73.19 C13.1
$1N7120: length 16.1
  Top Layer w0.254: C14.1 17.12,66.4 15.27,66.4 14.39,65.51 14.39,58.27 17.28,55.37 H11.2
$1N10840: length 3.1
  Top Layer w0.254: H8.1 5.2,37.84 4.19,36.82 4.19,35.81 R7.2
$1N12151: length 3.3
  Top Layer w0.254: R1.2 4.02,43.03 4.02,44.04 5.01,45.04 H4.1
$1N13840: length 3.8
  Top Layer w0.254: R2.2 33.23,45.35 33.59,44.98
$1N15786: length 5.6
  Top Layer w0.254: R5.2 33.57,42.42 33.59,42.39 33.59,41.72 33.78,41.53 33.78,40.65 R3.1 33.79,39 R4.1
$1N16226: length 1.9
  Top Layer w0.254: 37.08,39.18 37.02,39.12 36.19,39.12 36.07,38.99 R4.2
$1N17984: length 11.1
  Top Layer w0.254: 35.49,47.12 35.23,46.85 R2.1 ; 35.49,47.12 35.43,47.18 35.43,50.42 ; 35.49,47.12 35.5,47.11 U1.1
$1N20044: length 3.1
  Top Layer w0.254: R17.2 25.79,45.54 U3.3
$1N21295: length 5.7
  Top Layer w0.254: R18.1 R16.1 21.14,43.48 U3.4 21.37,43.71 21.37,45.92
$1N21739: length 1.9
  Top Layer w0.254: R18.2 18,41.92 18,40.06
$1N22287: length 2.9
  Top Layer w0.254: R22.2 37.34,85.6 36.96,85.98 C18.1
$1N22288: length 5.7
  Top Layer w0.254: R23.2 33.4,82.46 U5.4 35.63,82.61 R21.1 37.34,82.56
$1N22290: length 3
  Top Layer w0.254: U5.3 30.96,81.01 R20.2
$1N42520: length 2.5
  Top Layer w0.254: USBC1.B5 8.62,23.9 R10.2
$1N42526: length 2.5
  Top Layer w0.254: R12.1 8.62,26.9 USBC1.A5
$1N44676: length 2.5
  Top Layer w0.254: 61.21,7.3 LED2.2
$1N44679: length 2.5
  Top Layer w0.254: 36.32,7.35 LED3.1
$1N44681: length 2.3
  Top Layer w0.254: R28.1 LED1.2
$2N3215: length 7.5
  Top Layer w0.254: 69.47,74.3 70.23,73.53 R31.1 ; 69.47,74.3 69.47,76.71 70.13,77.37 U8.7 ; 69.47,74.3 68.71,73.53 C35.2
$2N3217: length 5.1
  Top Layer w0.254: C33.2 C34.2 69.34,77.34 70.01,78.02 U8.6
$2N3218: length 2.9
  Top Layer w0.254: U8.4 69.54,79.32 69.34,79.12 R26.2
$2N3219: length 1.8
  Top Layer w0.254: C32.2 66.81,80.84 R26.1
$2N3238: length 2.9
  Top Layer w0.254: U8.9 78.12,76.72 78.74,77.34 R27.1
$2N4733: length 13.5
  Top Layer w0.254: U7.7 75.16,61.11 75.56,60.71 75.56,58.8 75.06,58.29 72.39,58.29 70.99,56.9 70.99,55.63 71.63,54.99 U11.3
$2N4737: length 8.9
  Top Layer w0.254: 73.87,64.98 73.87,65.23 73.91,65.28 73.53,65.66 67.6,65.66 LED4.2
$2N4738: length 2.2
  Top Layer w0.254: LED4.1 R24.2
$2N4761: length 15.2
  Top Layer w0.508: v2(88.24,59.97) 88.24,57.74 88.26,57.72 88.26,55.37 87,54.1 R30.1
  Bottom Layer w0.508: v2(88.24,59.97) 93.83,59.97
$2N6887: length 15.2
  Top Layer w0.508: 93.83,41.04 U14.1 88.24,38.82 88.26,38.8 88.26,36.45 87,35.18 R33.1
$2N6893: length 13.3
  Top Layer w0.254: U13.7 75.03,42.19 75.44,41.78 75.44,40 75.06,39.62 72.39,39.62 71.12,38.35 71.12,36.45 71.5,36.07 U15.3
$2N6907: length 9
  Top Layer w0.254: U13.1 73.91,46.17 73.91,46.48 73.66,46.74 67.6,46.74 LED5.2
$2N6908: length 2.2
  Top Layer w0.254: LED5.1 R32.2
$2N7919: length 15.2
  Top Layer w0.508: R35.1 87,16.26 88.26,17.53 88.26,19.88 88.24,19.9 U18.1 93.83,22.12
$2N7925: length 13.9
  Top Layer w0.254: U16.7 75.79,23.27 76.33,22.73 76.33,20.83 75.95,20.45 72.52,20.45 71.88,19.81 71.88,17.53 72.26,17.15 U19.3
$2N7939: length 8.9
  Top Layer w0.254: U16.1 73.84,27.51 73.53,27.81 67.6,27.81 LED6.2
$2N7940: length 2.2
  Top Layer w0.254: LED6.1 R34.2

## Copper pours and planes (outline as drawn; the poured copper is in the pictures)
+5VLDO on Top Layer: 30.35,89.66 34.68,89.66 35.69,88.66 35.69,85.6 36.45,84.84 36.45,83.55 36.21,83.31 32.78,83.31 32.26,83.84 32.26,85.72 30.35,87.63
+12V on Top Layer: 39.5,43.69 41.4,41.78 42.04,41.78 42.04,39.12 38.61,39.12 37.85,39.87 34.91,39.87 34.54,40.24 34.54,43.69
-12V on Top Layer: 21.94,42.73 22.64,42.04 22.64,35.69 17.4,35.69 17.4,38.1 18.69,39.39 18.69,42.72 18.68,42.73
AGND on Top Layer: 23.24,89.53 38.86,89.53 38.86,76.96 23.24,76.96
AGND on Top Layer: 65.28,85.98 71.12,85.98 72.9,84.2 72.9,72.14 66.17,72.14 65.28,73.03
AGND on Top Layer: 52.24,47.34 75.35,47.34 75.6,47.09 75.6,42.77 77.51,40.87 85.38,40.87 86.65,42.14 86.65,45.06 88.05,46.45 97.7,46.45 98.97,45.18 98.97,32.99 97.57,31.6 52.24,31.6
AGND on Top Layer: 24.13,60.58 24.38,60.33 24.38,58.67 24.26,58.55 20.45,58.55 20.19,58.8 20.19,60.45 20.32,60.58
AGND on Top Layer: 52.32,28.7 75.44,28.7 75.69,28.45 75.69,24.13 77.6,22.22 85.47,22.22 86.74,23.5 86.74,26.42 88.14,27.81 97.79,27.81 99.06,26.54 99.06,14.35 97.66,12.95 52.32,12.95
AGND on Top Layer: 42,36.23 42,48.55 29,48.51 29,36.23
AGND on Top Layer: 15.62,34.72 28.31,34.72 28.31,41.78 25.65,41.78 25.27,42.16 23.24,42.16 22.99,42.42 22.99,47.88 22.48,48.39 17.02,48.39 15.62,46.99
AGND on Top Layer: 52.07,66.29 75.18,66.29 75.44,66.04 75.44,61.72 77.34,59.82 85.22,59.82 86.49,61.09 86.49,64.01 87.88,65.41 97.54,65.41 98.81,64.14 98.81,51.94 97.41,50.55 52.07,50.55
AGND on Top Layer: 25.84,64.83 25.84,66.56 30.95,71.67 35.27,71.67 35.78,71.29 35.78,68.75 35.27,68.37 30.83,68.37 30.19,67.74 30.19,65.71 29.3,64.82 25.85,64.82
AGND on Top Layer: 37.59,64.52 43.03,64.52 43.36,64.85 43.36,70.18 42.93,70.61 36.83,70.61 35.56,71.88 31.88,71.88 31.37,71.37 31.37,68.2 31.75,67.82 36.34,67.82 36.86,67.3 36.86,65.25
AGND on Bottom Layer: 39.24,76.58 45.21,76.58 46.35,75.44 46.35,56.01 43.94,53.59 43.94,33.48 12.95,33.48 12.95,18.74 -0.89,18.74 -0.89,-0.63 102.74,-0.63 102.74,101.73 39.24,101.73
AGND on Bottom Layer: 28.77,53.66 43.62,53.66 43.62,33.85 28.77,33.85
AGND on Bottom Layer: -1.14,103.76 40,103.76 40,90.04 22.73,90.04 22.73,85.23 -1.14,85.23
AGND on Bottom Layer: 16.38,53.59 28.19,53.59 28.19,33.84 12.79,33.84 12.79,50
AGND on Bottom Layer: 23.11,89.53 23.11,78.36 24.89,76.58 38.86,76.58 38.86,89.54 23.12,89.54
AGND on Bottom Layer: -1.65,84.96 22.73,84.96 22.73,77.98 24.51,76.2 44.96,76.2 45.85,75.31 45.85,56.13 43.81,54.1 16.26,54.1 12.19,50.04 12.19,19.05 -2.16,19.05 -2.29,18.92 -2.29,84.33
USB_VCC on Top Layer: 6.1,31.36 15.75,31.36 15.75,20.19 6.1,20.19
VNEG on Top Layer: 42.38,64.06 36.54,64.06 36.03,63.55 36.03,62.66 35.53,62.15 33.24,62.15 33.11,62.02 33.11,60.37 33.24,60.25 42.38,60.25
VPOS on Top Layer: 32.48,75.23 31.97,74.47 31.97,72.94 32.35,72.56 35.4,72.56 36.79,71.17 42.51,71.17 42.89,71.55 42.89,73.83 42.51,74.22 36.29,74.22 35.27,75.23
$1N2768 on Top Layer: 35.78,62.78 35.4,62.4 33.11,62.4 32.86,62.15 32.86,60.12 32.48,59.74 29.68,59.74 29.3,60.12 29.3,62.91 28.92,63.29 26,63.29 25.87,63.42 25.87,64.44 26,64.56 29.56,64.56 30.57,65.58 30.57,66.34 31.46,67.23 34.89,67.23 35.78,66.34
$1N17984 on Top Layer: 34.16,47.88 34.54,47.5 34.54,46.1 35.05,45.59 35.05,44.45 36.7,44.45 37.08,44.83 37.08,51.82 36.96,51.94 34.16,51.94
$1N19681 on Top Layer: 23.24,42.29 28.34,42.29 28.27,51.94 24.96,51.94 24.89,51.88 24.89,48.89 26.54,47.24 26.54,44.96 25.4,43.81 25.4,43.56 25.02,43.18 23.24,43.18
$1N22291 on Top Layer: 22.99,85.22 31.5,85.22 31.88,84.84 31.88,84.33 31.62,84.07 30.38,84.07 29.92,83.61 29.92,81.74 29.21,81.03 29.21,79.12 28.96,78.87 24.38,78.87 22.99,80.26

Small or netless copper shapes (teardrops, artwork), in the pictures only: 455 on Top Layer, 41 on Bottom Layer

## Text on the board
Bottom Silkscreen Layer: x | +3~+13.2V | ±15V(BOOSTER) | ±12V(LDO)/+5V(LDO) | ±10V | ±12.288V | ADC INPUT | DAC OUTPUT | POWER INPUT | POWER OUTPUT
Top Silkscreen Layer: 1.2M | SEQ. | SLOW | OFF | EXT | MAN. | FAST | 2.4M | NORM. | SIM. | ON | GND | FB2 | FB1 | COMP2 | COMP1 | SEQ | SYNC/FREQ | SLEW | EN1 | EN2 | SS | V_EN | + | -12VIND | +12VIND | 5VIND | +5V_EN | -12V_EN | +12V_EN | GND | SDI2 | SCK2 | SYN1 | SYN2 | SYN3 | 3V3 | SDI1 | CS1 | SCK1 | SDO1 | GND | VNEG | VPOS | +12V | -12V | +5V | POWER_IN | ADC_IN | DAC2 | DAC0 | DAC1
